# EAGLE design SparkFun_MicroMod_ESP32 (EAGLE 9.5.2)
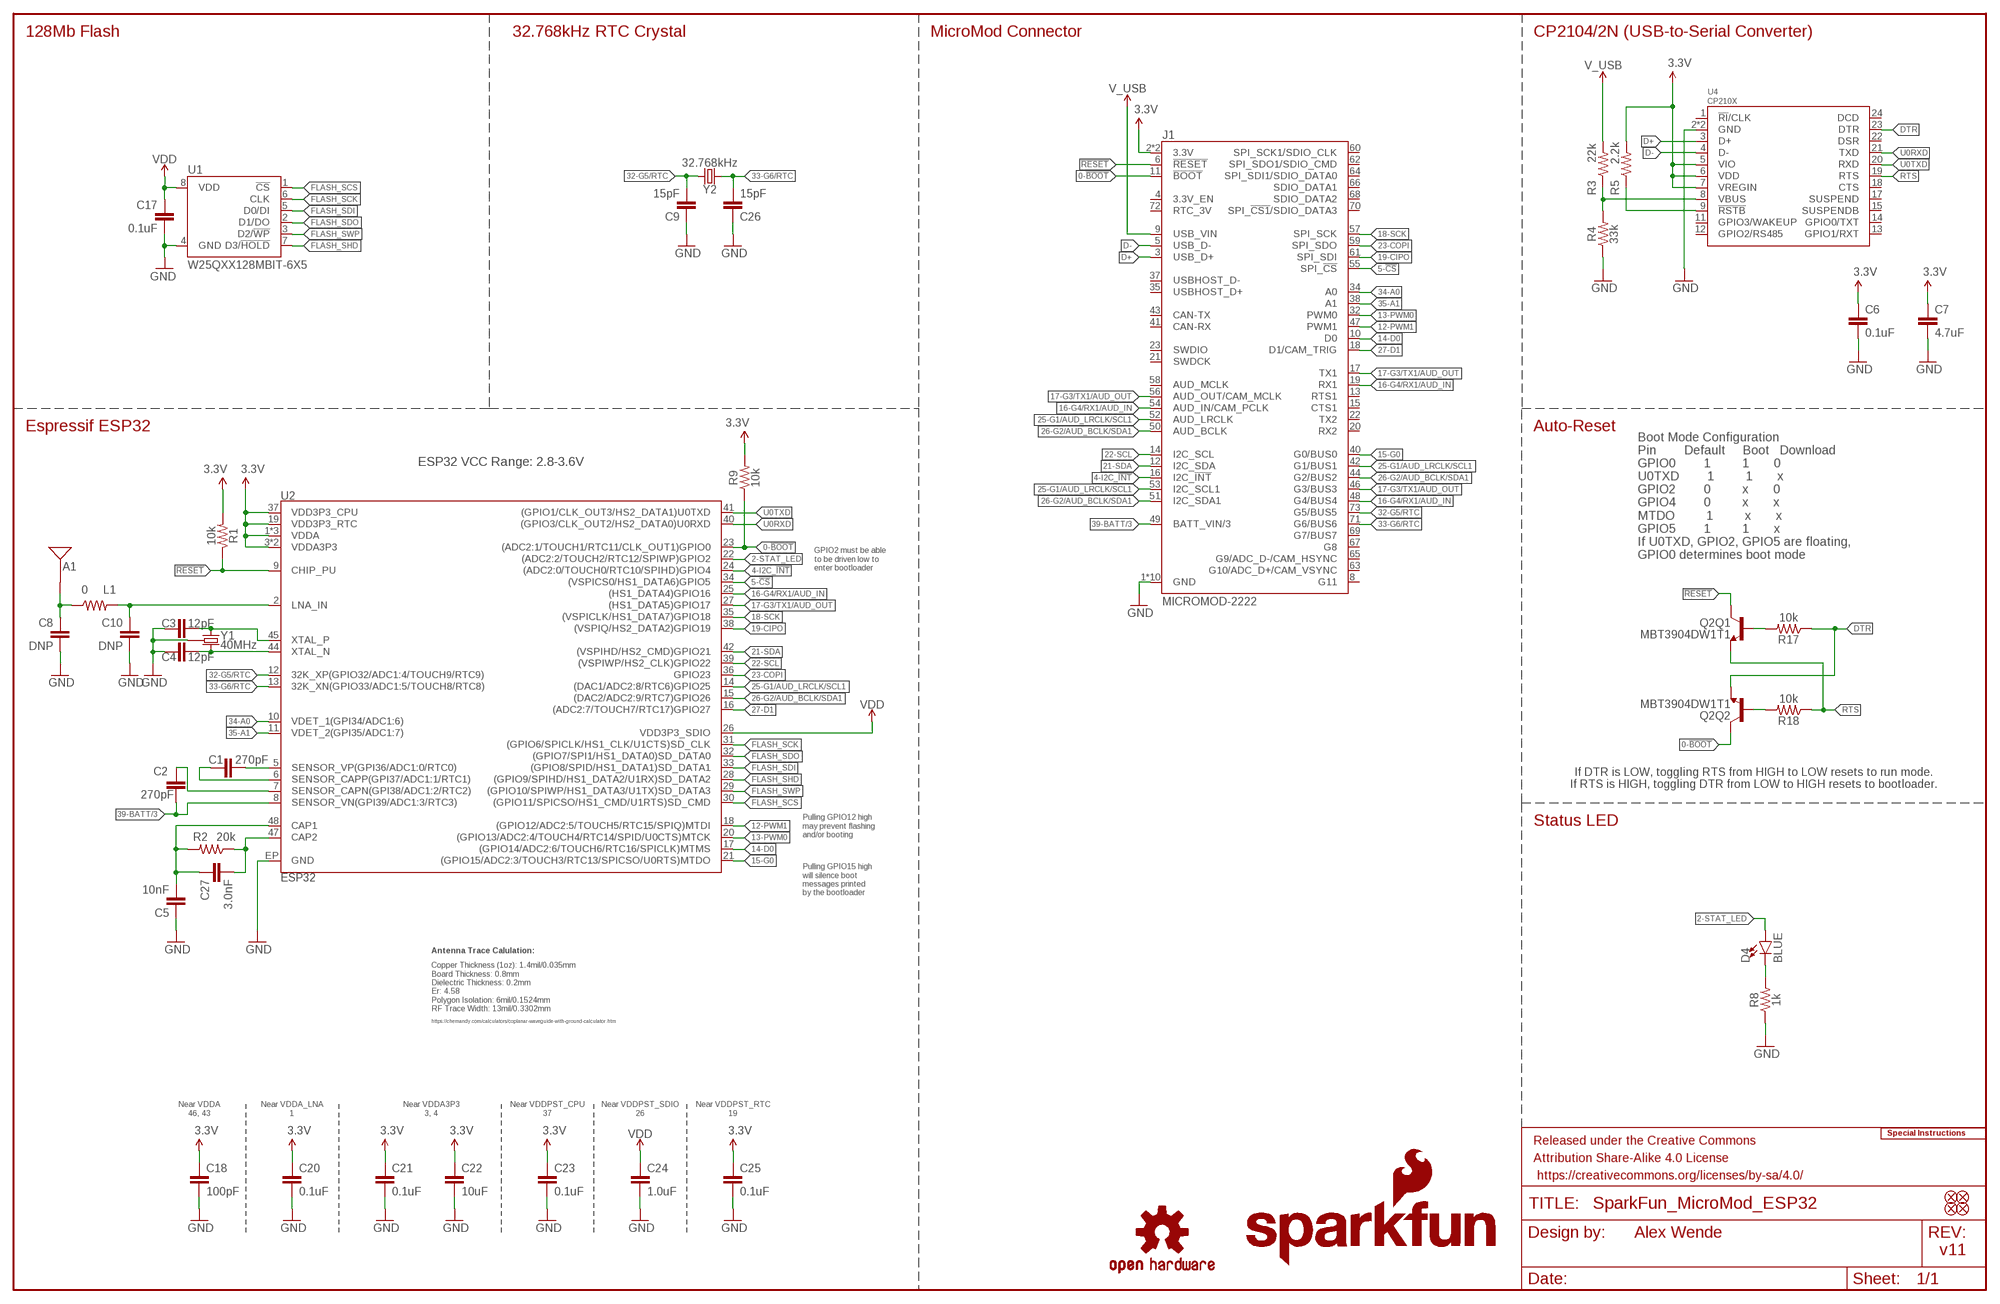
[diagram p0: schematic, sheet 1]

## Parts
A1  ANTENNA2.4GHZ-8.0X1.0MM  [ANT-2.4GHZ-8.0X1.0MM]
C1  270pF  270PF-0402T-50V-5%  [0402-TIGHT]
C2  270pF  270PF-0402T-50V-5%  [0402-TIGHT]
C3  12pF  12PF-0402T-50V-5%  [0402-TIGHT]
C4  12pF  12PF-0402T-50V-5%  [0402-TIGHT]
C5  10nF  10NF-0402T-25V-10%  [0402-TIGHT]
C6  0.1uF  0.1UF-0402T-16V-10%  [0402-TIGHT]
C7  4.7uF  4.7UF-0402_TIGHT-6.3V-20%-X5R  [0402-TIGHT]
C8  DNP  CAP-0402-TIGHT  [0402-TIGHT]
C9  15pF  15PF-0402T-50V-5%  [0402-TIGHT]
C10  DNP  CAP-0402-TIGHT  [0402-TIGHT]
C17  0.1uF  0.1UF-0402T-16V-10%  [0402-TIGHT]
C18  100pF  100PF-0402T-50V-5%  [0402-TIGHT]
C20  0.1uF  0.1UF-0402T-16V-10%  [0402-TIGHT]
C21  0.1uF  0.1UF-0402T-16V-10%  [0402-TIGHT]
C22  10uF  10UF-0402T-6.3V-20%  [0402-TIGHT]
C23  0.1uF  0.1UF-0402T-16V-10%  [0402-TIGHT]
C24  1.0uF  1.0UF-0402T-16V-10%  [0402-TIGHT]
C25  0.1uF  0.1UF-0402T-16V-10%  [0402-TIGHT]
C26  15pF  15PF-0402T-50V-5%  [0402-TIGHT]
C27  3.0nF  3.0NF-0402T-50V-5%  [0402-TIGHT]
D4  BLUE  LED-BLUE0603  [LED-0603]
FD1  FIDUCIALUFIDUCIAL  [FIDUCIAL-MICRO]
FD2  FIDUCIALUFIDUCIAL  [FIDUCIAL-MICRO]
FD3  FIDUCIALUFIDUCIAL  [FIDUCIAL-MICRO]
FD4  FIDUCIALUFIDUCIAL  [FIDUCIAL-MICRO]
FRAME1  FRAME-LEDGER  [CREATIVE_COMMONS]
J1  MICROMOD-2222  [M.2-CARD-E-22]
L1  0  0OHM-0402T-1/10W  [0402-TIGHT]
LOGO1  SPECIAL_INSTRUCTIONS-ORDERING  [ORDERING_INSTRUCTIONS]
LOGO2  SFE_LOGO_NAME_FLAME.1_INCH  [SFE_LOGO_NAME_FLAME_.1]
LOGO3  OSHW-LOGOS  [OSHW-LOGO-S]
Q2  MBT3904DW1T1  TRANS_NPN_DUAL-MBT3904DW1T1  [SC70-6]
R1  10k  10KOHM-0402T-1/16W-1%  [0402-TIGHT]
R2  20k  20KOHM-0402T-1/16W-1%  [0402-TIGHT]
R3  22k  22KOHM-0402_TIGHT-1/10W-1%  [0402-TIGHT]
R4  33k  33KOHM-0402T-1/16W-1%  [0402-TIGHT]
R5  2.2k  2.2KOHM-0402T-1/16W-1%  [0402-TIGHT]
R8  1k  1KOHM-0402T-1/16W-1%  [0402-TIGHT]
R9  10k  10KOHM-0402T-1/16W-1%  [0402-TIGHT]
R17  10k  10KOHM-0402T-1/16W-1%  [0402-TIGHT]
R18  10k  10KOHM-0402T-1/16W-1%  [0402-TIGHT]
U1  W25QXX128MBIT-6X5  [WSON-8-6X5]
U2  ESP32  [QFN48-0.4MM]
U4  CP210X  CP2102N  [QFN24]
Y1  40MHz  CRYSTAL-40MHZ-SMD-2X2.5MM  [CRYSTAL-SMD-2X2.5MM]
Y2  32.768kHz  CRYSTAL-32.768KHZSMD-3.2X1.5  [CRYSTAL-SMD-3.2X1.5MM]

## Nets
0-!BOOT!: J1.11(!BOOT!) Q2.6(Q2:C) R9.1 U2.23((ADC2:1/TOUCH1/RTC11/CLK_OUT1)GPIO0)
2-STAT_LED: D4.A U2.22((ADC2:2/TOUCH2/RTC12/SPIWP)GPIO2)
3.3V: C6.1 C7.1 C18.1 C20.1 C21.1 C22.1 C23.1 C25.1 J1.2(3.3V) J1.74(3.3V) R1.2 R5.2 R9.2 U2.1(VDDA) U2.3(VDDA3P3) U2.4(VDDA3P3) U2.19(VDD3P3_RTC) U2.37(VDD3P3_CPU) U2.43(VDDA) U2.46(VDDA) U4.5(VIO) U4.6(VDD) U4.7(VREGIN)
4-I2C_!INT: J1.16(I2C_!INT!) U2.24((ADC2:0/TOUCH0/RTC10/SPIHD)GPIO4)
5-!CS: J1.55(SPI_!CS!) U2.34((VSPICS0/HS1_DATA6)GPIO5)
12-PWM1: J1.47(PWM1) U2.18((GPIO12/ADC2:5/TOUCH5/RTC15/SPIQ)MTDI)
13-PWM0: J1.32(PWM0) U2.20((GPIO13/ADC2:4/TOUCH4/RTC14/SPID/U0CTS)MTCK)
14-D0: J1.10(D0) U2.17((GPIO14/ADC2:6/TOUCH6/RTC16/SPICLK)MTMS)
15-G0: J1.40(G0/BUS0) U2.21((GPIO15/ADC2:3/TOUCH3/RTC13/SPICSO/U0RTS)MTDO)
16-G4/RX1/AUD_IN: J1.19(RX1) J1.48(G4/BUS4) J1.54(AUD_IN/CAM_PCLK) U2.25((HS1_DATA4)GPIO16)
17-G3/TX1/AUD_OUT: J1.17(TX1) J1.46(G3/BUS3) J1.56(AUD_OUT/CAM_MCLK) U2.27((HS1_DATA5)GPIO17)
18-SCK: J1.57(SPI_SCK) U2.35((VSPICLK/HS1_DATA7)GPIO18)
19-CIPO: J1.61(SPI_SDI) U2.38((VSPIQ/HS2_DATA2)GPIO19)
21-SDA: J1.12(I2C_SDA) U2.42((VSPIHD/HS2_CMD)GPIO21)
22-SCL: J1.14(I2C_SCL) U2.39((VSPIWP/HS2_CLK)GPIO22)
23-COPI: J1.59(SPI_SDO) U2.36(GPIO23)
25-G1/AUD_LRCLK/SCL1: J1.42(G1/BUS1) J1.52(AUD_LRCLK) J1.53(I2C_SCL1) U2.14((DAC1/ADC2:8/RTC6)GPIO25)
26-G2/AUD_BCLK/SDA1: J1.44(G2/BUS2) J1.50(AUD_BCLK) J1.51(I2C_SDA1) U2.15((DAC2/ADC2:9/RTC7)GPIO26)
27-D1: J1.18(D1/CAM_TRIG) U2.16((ADC2:7/TOUCH7/RTC17)GPIO27)
32-G5/RTC: C9.2 J1.73(G5/BUS5) U2.12(32K_XP(GPIO32/ADC1:4/TOUCH9/RTC9)) Y2.P$1
33-G6/RTC: C26.2 J1.71(G6/BUS6) U2.13(32K_XN(GPIO33/ADC1:5/TOUCH8/RTC8)) Y2.P$2
34-A0: J1.34(A0) U2.10(VDET_1(GPI34/ADC1:6))
35-A1: J1.38(A1) U2.11(VDET_2(GPI35/ADC1:7))
36: C1.2 U2.5(SENSOR_VP(GPI36/ADC1:0/RTC0))
37: C1.1 U2.6(SENSOR_CAPP(GPI37/ADC1:1/RTC1))
38: C2.1 U2.7(SENSOR_CAPN(GPI38/ADC1:2/RTC2))
39-BATT/3: C2.2 J1.49(BATT_VIN/3) U2.8(SENSOR_VN(GPI39/ADC1:3/RTC3))
!RESET: J1.6(!RESET!) Q2.3(Q1:C) R1.1 U2.9(CHIP_PU)
CAP_10N: C5.2 C27.1 R2.2 U2.48(CAP1)
D+: J1.3(USB_D+) U4.3(D+)
D-: J1.5(USB_D-) U4.4(D-)
DTR: Q2.1(Q2:E) R17.1 U4.23(DTR)
FLASH_SCK: U1.6(CLK) U2.31((GPIO6/SPICLK/HS1_CLK/U1CTS)SD_CLK)
FLASH_SCS: U1.1(!CS!) U2.30((GPIO11/SPICSO/HS1_CMD/U1RTS)SD_CMD)
FLASH_SDI: U1.5(D0/DI) U2.33((GPIO8/SPID/HS1_DATA1)SD_DATA1)
FLASH_SDO: U1.2(D1/DO) U2.32((GPIO7/SPI1/HS1_DATA0)SD_DATA0)
FLASH_SHD: U1.7(D3/!HOLD!) U2.28((GPIO9/SPIHD/HS1_DATA2/U1RX)SD_DATA2)
FLASH_SWP: U1.3(D2/!WP!) U2.29((GPIO10/SPIWP/HS1_DATA3/U1TX)SD_DATA3)
GND: C3.1 C4.1 C5.1 C6.2 C7.2 C8.2 C9.1 C10.2 C17.2 C18.2 C20.2 C21.2 C22.2 C23.2 C24.2 C25.2 C26.1 J1.1(GND) J1.7(GND) J1.33(GND) J1.36(GND) J1.39(GND) J1.45(GND) J1.75(GND) J1.GND1(GND) J1.GND2(GND) J1.GND3(GND) R4.1 R8.1 U1.4(GND) U2.EP(GND) U4.2(GND) U4.PAD(GND) Y1.P2(GND) Y1.P4(GND)
N$1: D4.C R8.2
N$2: R3.1 R4.2 U4.8(VBUS)
N$3: R5.1 U4.9(!RSTB)
N$4: C27.2 R2.1 U2.47(CAP2)
N$5: A1.FEED(SIGNAL) C8.1 L1.1
N$8: C10.1 L1.2 U2.2(LNA_IN)
N$10: Q2.5(Q1:B) R17.2
N$12: Q2.2(Q2:B) R18.2
N$13: C3.2 U2.45(XTAL_P) Y1.P1
N$15: C4.2 U2.44(XTAL_N) Y1.P3
RTS: Q2.4(Q1:E) R18.1 U4.19(RTS)
U0RXD: U2.40((GPIO3/CLK_OUT2/HS2_DATA0)U0RXD) U4.21(TXD)
U0TXD: U2.41((GPIO1/CLK_OUT3/HS2_DATA1)U0TXD) U4.20(RXD)
V_USB: J1.9(USB_VIN) R3.2
VDD: C17.1 C24.1 U1.8(VDD) U2.26(VDD3P3_SDIO)
Unconnected: J1.4(3.3V_EN) J1.8(G11) J1.13(RTS1) J1.15(CTS1) J1.20(RX2) J1.21(SWDCK) J1.22(TX2) J1.23(SWDIO) J1.35(USBHOST_D+) J1.37(USBHOST_D-) J1.41(CAN-RX) J1.43(CAN-TX) J1.58(AUD_MCLK) J1.60(SPI_SCK1/SDIO_CLK) J1.62(SPI_SDO1/SDIO_CMD) J1.63(G10/ADC_D+/CAM_VSYNC) J1.64(SPI_SDI1/SDIO_DATA0) J1.65(G9/ADC_D-/CAM_HSYNC) J1.66(SDIO_DATA1) J1.67(G8) J1.68(SDIO_DATA2) J1.69(G7/BUS7) J1.70(SPI_!CS1!/SDIO_DATA3) J1.72(RTC_3V) U4.1(!RI!/CLK) U4.11(GPIO3/WAKEUP) U4.12(GPIO2/RS485) U4.13(GPIO1/RXT) U4.14(GPIO0/TXT) U4.15(SUSPENDB) U4.17(SUSPEND) U4.18(CTS) U4.22(DSR) U4.24(DCD)

## Notes on the sheet
- 128Mb Flash | 32.768kHz RTC Crystal | MicroMod Connector | CP2104/2N (USB-to-Serial Converter)
- Espressif ESP32 | Auto-Reset
- ESP32 VCC Range: 2.8-3.6V
- Boot Mode Configuration
  Pin        Default     Boot   Download
  GPIO0        1         1       0
  U0TXD        1         1       x
  GPIO2        0         x       0
  GPIO4        0         x       x
  MTDO         1         x       x
  GPIO5        1         1       x
  If U0TXD, GPIO2, GPIO5 are floating, 
  GPIO0 determines boot mode
- GPIO2 must be able
  to be driven low to 
  enter bootloader
- If DTR is LOW, toggling RTS from HIGH to LOW resets to run mode.
  If RTS is HIGH, toggling DTR from LOW to HIGH resets to bootloader.
- Status LED
- Pulling GPIO12 high
  may prevent flashing
  and/or booting
- Pulling GPIO15 high
  will silence boot
  messages printed
  by the bootloader
- Antenna Trace Calulation:
- Copper Thickness (1oz): 1.4mil/0.035mm
  Board Thickness: 0.8mm
  Dielectric Thickness: 0.2mm
  Er: 4.58
  Polygon Isolation: 6mil/0.1524mm
  RF Trace Width: 13mil/0.3302mm
- https://chemandy.com/calculators/coplanar-waveguide-with-ground-calculator.htm
- Near VDDA
  46, 43
- Near VDDA_LNA
  1
- Near VDDA3P3
  3, 4
- Near VDDPST_CPU
  37
- Near VDDPST_SDIO
  26
- Near VDDPST_RTC
  19
- Alex Wende
- v11

## Library data of the parts
A1 = SparkFun-RF:ANTENNA: Single-ended Antennae 2.4GHz and antennae with just one terminal. These are all chip antennae. 2.4GHz (WiFi/BT/ZigBee) Antennae ANT-2.4GHZ-6.5X2.2MM - 6.5 x 2.2 mm chip antenna. (SparkFun Product <https://www.sparkfun.com/products/144>) ANT-2.4GHZ8.0X1.0MM - 8.0 x 1.0 mm chip antenna. (Datasheet <http://www.mouser.com/ds/2/611/antenna_2500at44m0400-242425.pdf>) ANT-2.4GHZ9.5X2.0MM - 9.5 x 2.0 mm chip antenna. (SparkFun Product <https://www.sparkfun.com/products/9025>); PROD_ID: ANT-14377
C1 C2 = SparkFun-Capacitors:270PF: 270pF/0.27nF ceramic capacitors A capacitor is a passive two-terminal electrical component used to store electrical energy temporarily in an electric field.; PROD_ID: CAP-15129
C3 C4 = SparkFun-Capacitors:12PF: 12pF ceramic capacitors A capacitor is a passive two-terminal electrical component used to store electrical energy temporarily in an electric field.; PROD_ID: CAP-14665
C5 = SparkFun-Capacitors:10NF: 0.01uF/10nF/10,000pF ceramic capacitors A capacitor is a passive two-terminal electrical component used to store electrical energy temporarily in an electric field. CAP-09321; PROD_ID: CAP-14847
C6 C17 C20 C21 C23 C25 = SparkFun-Capacitors:0.1UF: 0.1µF ceramic capacitors A capacitor is a passive two-terminal electrical component used to store electrical energy temporarily in an electric field.; PROD_ID: CAP-12416
C7 = SparkFun-Capacitors:4.7UF: 4.7µF ceramic capacitors A capacitor is a passive two-terminal electrical component used to store electrical energy temporarily in an electric field.; PROD_ID: CAP-14240
C8 C10 = SparkFun-Capacitors:CAP
C9 C26 = SparkFun-Capacitors:15PF: 15pF ceramic capacitors A capacitor is a passive two-terminal electrical component used to store electrical energy temporarily in an electric field.; PROD_ID: CAP-13063
C18 = SparkFun-Capacitors:100PF: 100pF/0.1nF ceramic capacitors A capacitor is a passive two-terminal electrical component used to store electrical energy temporarily in an electric field.; PROD_ID: CAP-13458
C22 = SparkFun-Capacitors:10UF: 10.0µF ceramic capacitors A capacitor is a passive two-terminal electrical component used to store electrical energy temporarily in an electric field.; PROD_ID: CAP-14848
C24 = SparkFun-Capacitors:1.0UF: 1µF ceramic capacitors A capacitor is a passive two-terminal electrical component used to store electrical energy temporarily in an electric field.; PROD_ID: CAP-12417
C27 = SparkFun-Capacitors:3.0NF: 3.0nF (3nF, 3000pF) ceramic capacitors A capacitor is a passive two-terminal electrical component used to store electrical energy temporarily in an electric field.; PROD_ID: CAP-15130
D4 = SparkFun-LED:LED-BLUE: Blue SMD LED Used in manufacturing of various products at SparkFun Packages: 0603 - SMD 0603 package [Product Link] <http://www.digikey.com/product-detail/en/SMLE12BC7TT86/511-1589-2-ND/1641808> 1206 - SMD1206 package [Product Link] <http://www.digikey.com/product-detail/en/lite-on-inc/LTST-C150TBKT/160-1643-1-ND/573584> SparkFun Products: ESP8266 Thing-Dev Board <https://www.sparkfun.com/products/13711> RedBoard <https://www.sparkfun.com/products/12757>; PROD_ID: DIO-08575
FD1-FD4 = SparkFun-Aesthetics:FIDUCIAL: Fiducial Alignment Points Point-of-reference for pick-and-place machines and other optical instruments.
FRAME1 = SparkFun-Aesthetics:FRAME-LEDGER: Schematic Frame - Ledger Standard 11x14 US Ledger frame
J1 = SparkFun-MicroMod:MICROMOD: MicroMod Connector Description: A card edge connector and mating PCB connector to allow various MicroMod Processor Boards to be coupled with various carrier boards of different capabilities. Based on the M.2 standard.
L1 = SparkFun-Resistors:0OHM: 0Ω resistor A resistor is a passive two-terminal electrical component that implements electrical resistance as a circuit element. Resistors act to reduce current flow, and, at the same time, act to lower voltage levels within circuits. - Wikipedia; PROD_ID: RES-14244
LOGO1 = SparkFun-Aesthetics:SPECIAL_INSTRUCTIONS: Special Ordering/Production Instructions Alert Symbol for special PCB ordering instructions or unique production process warnings. Ordering Instructions Production Instructions Types of information that should be added to box: Copper weight Soldermask color Silk color PCB thickness Number of layers PCB Standard: 1.6mm FR4 1 oz copper immersion silver plating red soldermask white silkscreen Types of information that should be added to box: Special wash requirements Depaneling instructions Humidification Glue curing Default text settings: 0.07 inch 9% ratio 50% line distance
LOGO2 = SparkFun-Aesthetics:SFE_LOGO_NAME_FLAME: SparkFun Font Logo w/ Flame This is the SparkFun full logo. The logo on the schematic will always be the same size; the package variant is the height of the flame part of the logo. Default layer for the logo on the board is tSilk.
LOGO3 = SparkFun-Aesthetics:OSHW-LOGO: Open-Source Hardware (OSHW) Logo This logo indicates the piece of hardware it is found on incorporates a OSHW license and/or adheres to the definition of open source hardware found here: http://freedomdefined.org/OSHW
Q2 = SparkFun-DiscreteSemi:TRANS_NPN_DUAL: Dual NPN Transistors in Single Package The MBT3904W1 puts two general purpose 3904 NPN transistors in a single package. Datasheet <http://www.onsemi.com/pub_link/Collateral/MBT3904DW1T1-D.PDF> SparkFun Products: SparkFun ESP32 Thing <https://www.sparkfun.com/products/13907>; PROD_ID: TRANS-13337
R1 R9 R17 R18 = SparkFun-Resistors:10KOHM: 10kΩ resistor A resistor is a passive two-terminal electrical component that implements electrical resistance as a circuit element. Resistors act to reduce current flow, and, at the same time, act to lower voltage levels within circuits. - Wikipedia; PROD_ID: RES-14241
R2 = SparkFun-Resistors:20KOHM: 20kΩ resistor A resistor is a passive two-terminal electrical component that implements electrical resistance as a circuit element. Resistors act to reduce current flow, and, at the same time, act to lower voltage levels within circuits. - Wikipedia; PROD_ID: RES-15131
R3 = SparkFun-Resistors:22KOHM: 22kΩ resistor A resistor is a passive two-terminal electrical component that implements electrical resistance as a circuit element. Resistors act to reduce current flow, and, at the same time, act to lower voltage levels within circuits. - Wikipedia; PROD_ID: RES-14281
R4 = SparkFun-Resistors:33KOHM: 33kΩ resistor A resistor is a passive two-terminal electrical component that implements electrical resistance as a circuit element. Resistors act to reduce current flow, and, at the same time, act to lower voltage levels within circuits. - Wikipedia; PROD_ID: RES-15128
R5 = SparkFun-Resistors:2.2KOHM: 2.2kΩ resistor A resistor is a passive two-terminal electrical component that implements electrical resistance as a circuit element. Resistors act to reduce current flow, and, at the same time, act to lower voltage levels within circuits. - Wikipedia; PROD_ID: RES-14341
R8 = SparkFun-Resistors:1KOHM: 1kΩ resistor A resistor is a passive two-terminal electrical component that implements electrical resistance as a circuit element. Resistors act to reduce current flow, and, at the same time, act to lower voltage levels within circuits. - Wikipedia; PROD_ID: RES-14342
U1 = SparkFun-MicroMod:W25QXX; PROD_ID: IC-15107
U2 = SparkFun-RF:ESP32: Espressif ESP32 WiFi-compatible SoC microcontroller. Bluetooth Low energy support (BLE, BT4.0, Bluetooth Smart) 28 GPIO pins Dual-core Tensilica LX6 microprocessor Hardware accelerated encryption (AES, SHA2, ECC, RSA-4096) 4MB Flash memory 520kB internal SRAM Datasheet <https://cdn.sparkfun.com/datasheets/IoT/esp32_datasheet_en.pdf> SparkFun Products: SparkFun ESP32 Thing <https://www.sparkfun.com/products/13907>; PROD_ID: IC-13338
U4 = SparkFun-IC-Comms:CP2102N; PROD_ID: IC-14020
Y1 = SparkFun-Clocks:CRYSTAL-40MHZ: 40MHz Crystal w/ Ground Pin Digikey Example <https://www.digikey.com/product-detail/en/epson/FA-20H-40-0000MF10Z-K3/SER4045CT-ND/5175137> Frequency: 40MHz Frequency Stability: ±10ppm Frequency Tolerance: ±10ppm Load Capacitance: 10pF; PROD_ID: XTAL-15127; VALUE: 40MHZ
Y2 = SparkFun-Clocks:CRYSTAL-32.768KHZ: 32.768kHz Crystal Frequency: 32.768kHz Frequency Stability: ±20ppm Load Capacitance: 12.5pF (PTH-2X6 & SMD-3.2X1.5), 6pF (SMD-2X6) SparkFun Products: SparkFun BigTime Watch Kit <https://www.sparkfun.com/products/11734> SparkFun nRF52832 Breakout <https://www.sparkfun.com/products/13990> SparkFun Real Time Clock Module <https://www.sparkfun.com/products/12708>; PROD_ID: XTAL-13062

## Board
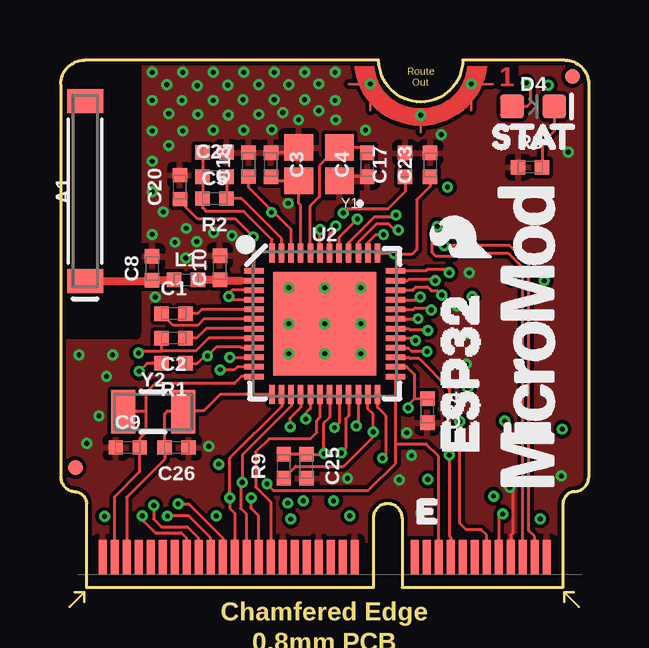
[diagram p1: board, top side]
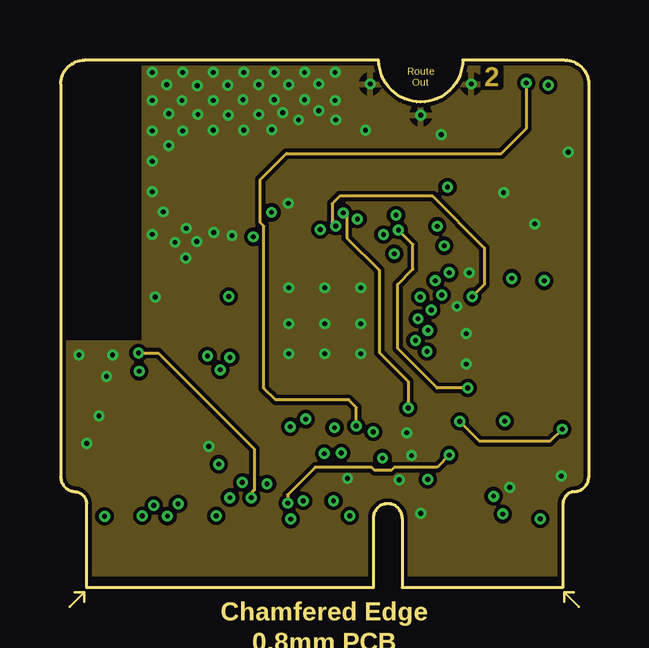
[diagram p2: board, inner layer GND]
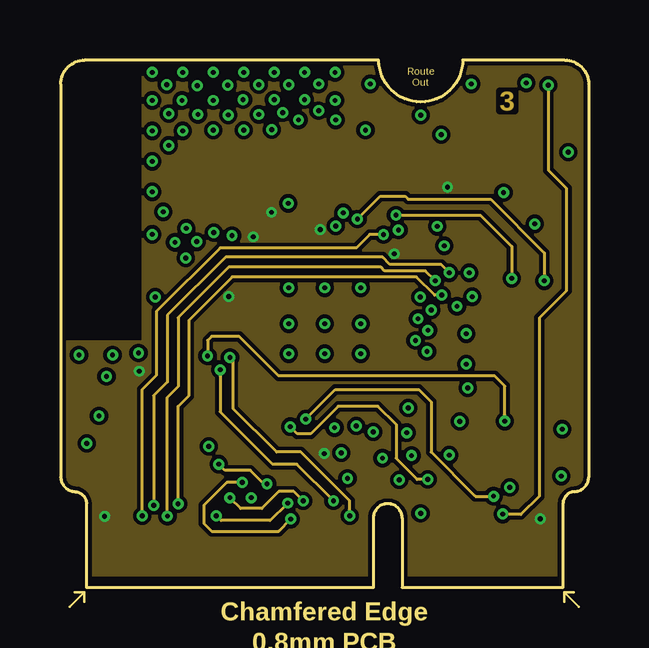
[diagram p3: board, inner layer PWR]
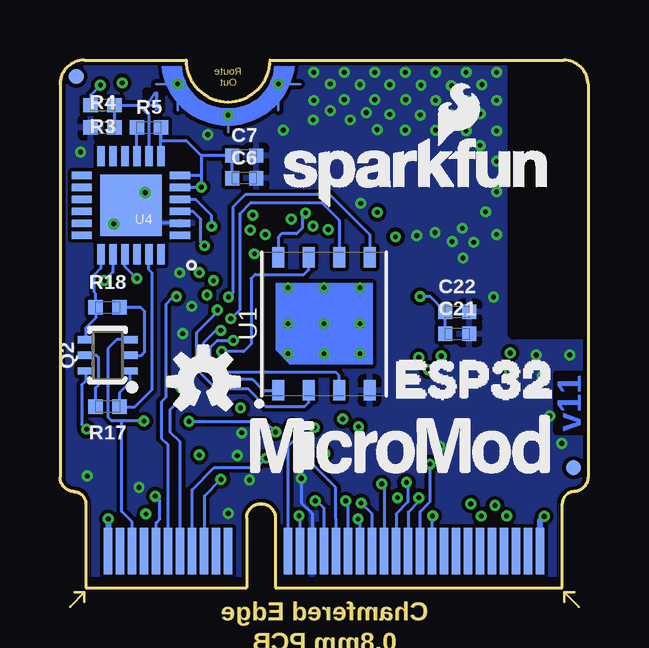
[diagram p4: board, bottom side, seen from below]

Size 22 x 22 mm. Coordinates in mm from the lower left corner, seen from the top.
Outline: 16.75,22 21,22 arc-87 22,21 22,4.6 arc-87 21.4,4 arc85 20.93,3.5 20.93,0 14.22,0 14.22,2.9 arc180 13.03,2.9 13.03,0 1.07,0 1.07,3.5 arc84 0.6,4 arc-87 0,4.6 0,21 arc-87 1,22 13.25,22
Outline: 16.75,22 arc-180 13.25,22
Outline: 16.75,22 arc-180 13.25,22
Copper layers (1*2*15*16): Top 0.035559375mm / dielectric 0.47751875mm / GND 0.035559375mm / dielectric 0.47751875mm / PWR 0.035559375mm / dielectric 0.47751875mm / Bottom 0.035559375mm
Design rules "SparkFun-4-layer-FAB-LIMIT": minimum track width 4mil, minimum drill 6mil, track to track 5mil, track to pad 5mil, pad to pad 5mil, via to via 5mil, smd to smd 5mil, copper to edge 4mil, drill to drill 4mil, minimum pad ring 5mil, minimum via ring 5mil, stop-mask expansion 4mil, vias tented up to drill 25mil, thermal gap 10mil
tRestrict: area 0,10.6 to 3.1,22
bRestrict: area 0,10.6 to 3.1,22; 4 lines

### Footprints (pad centres in the part's own frame; a part is rotated, then mirrored left to right if it is on the bottom)
ANT-2.4GHZ-8.0X1.0MM = smd 1 x 1.5: FEED -3.75,0; NC 3.75,0
0402-TIGHT = smd 0.6 x 0.6: 1 -0.5,0; 2 0.5,0
LED-0603 = smd 1 x 1: A -0.877,0; C 0.877,0
FIDUCIAL-MICRO = smd 0.635 x 0.635: 1 0,0
M.2-CARD-E-22 = smd 0.35 x 1.45: 1 9.25,1.275; 3 8.75,1.275; 5 8.25,1.275; 7 7.75,1.275; 9 7.25,1.275; 11 6.75,1.275; 13 6.25,1.275; 15 5.75,1.275; 17 5.25,1.275; 19 4.75,1.275; 21 4.25,1.275; 23 3.75,1.275; 33 1.25,1.275; 35 0.75,1.275; 37 0.25,1.275; 39 -0.25,1.275; 41 -0.75,1.275; 43 -1.25,1.275; 45 -1.75,1.275; 47 -2.25,1.275; 49 -2.75,1.275; 51 -3.25,1.275; 53 -3.75,1.275; 55 -4.25,1.275; 57 -4.75,1.275; 59 -5.25,1.275; 61 -5.75,1.275; 63 -6.25,1.275; 65 -6.75,1.275; 67 -7.25,1.275; 69 -7.75,1.275; 71 -8.25,1.275; 73 -8.75,1.275; 75 -9.25,1.275 | smd 0.35 x 1.95 bottom: 2 9,1.525; 4 8.5,1.525; 6 8,1.525; 8 7.5,1.525; 10 7,1.525; 12 6.5,1.525; 14 6,1.525; 16 5.5,1.525; 18 5,1.525; 20 4.5,1.525; 22 4,1.525; 32 1.5,1.525; 34 1,1.525; 36 0.5,1.525; 38 0,1.525; 40 -0.5,1.525; 42 -1,1.525; 44 -1.5,1.525; 46 -2,1.525; 48 -2.5,1.525; 50 -3,1.525; 52 -3.5,1.525; 54 -4,1.525; 56 -4.5,1.525; 58 -5,1.525; 60 -5.5,1.525; 62 -6,1.525; 64 -6.5,1.525; 66 -7,1.525; 68 -7.5,1.525; 70 -8,1.525; 72 -8.5,1.525; 74 -9,1.525 | drill 0.2: GND1 1.9,21; GND2 4,19.7; GND3 6.1,21
SC70-6 = smd 0.3 x 0.66: 1 -0.65,-0.92; 2 0,-0.92; 3 0.65,-0.92; 4 0.65,0.92; 5 0,0.92; 6 -0.65,0.92
WSON-8-6X5 = smd 0.85 x 0.5: 1 -2.775,1.905; 2 -2.775,0.635; 3 -2.775,-0.635; 4 -2.775,-1.905; 5 2.775,-1.905; 6 2.775,-0.635; 7 2.775,0.635; 8 2.775,1.905
QFN48-0.4MM = smd 0.8 x 0.23: 1 -2.95,2.2; 2 -2.95,1.8; 3 -2.95,1.4; 4 -2.95,1; 5 -2.95,0.6; 6 -2.95,0.2; 7 -2.95,-0.2; 8 -2.95,-0.6; 9 -2.95,-1; 10 -2.95,-1.4; 11 -2.95,-1.8; 12 -2.95,-2.2; 25 2.95,-2.2; 26 2.95,-1.8; 27 2.95,-1.4; 28 2.95,-1; 29 2.95,-0.6; 30 2.95,-0.2; 31 2.95,0.2; 32 2.95,0.6; 33 2.95,1; 34 2.95,1.4; 35 2.95,1.8; 36 2.95,2.2 | smd 0.23 x 0.8: 13 -2.2,-2.95; 14 -1.8,-2.95; 15 -1.4,-2.95; 16 -1,-2.95; 17 -0.6,-2.95; 18 -0.2,-2.95; 19 0.2,-2.95; 20 0.6,-2.95; 21 1,-2.95; 22 1.4,-2.95; 23 1.8,-2.95; 24 2.2,-2.95; 37 2.2,2.95; 38 1.8,2.95; 39 1.4,2.95; 40 1,2.95; 41 0.6,2.95; 42 0.2,2.95; 43 -0.2,2.95; 44 -0.6,2.95; 45 -1,2.95; 46 -1.4,2.95; 47 -1.8,2.95; 48 -2.2,2.95 | smd 4.3 x 4.3: EP 0,0
QFN24 = smd 0.85 x 0.3: 1 -2.05,1.25; 2 -2.05,0.75; 3 -2.05,0.25; 4 -2.05,-0.25; 5 -2.05,-0.75; 6 -2.05,-1.25; 13 2.05,-1.25; 14 2.05,-0.75; 15 2.05,-0.25; 16 2.05,0.25; 17 2.05,0.75; 18 2.05,1.25 | smd 0.3 x 0.85: 7 -1.25,-2.05; 8 -0.75,-2.05; 9 -0.25,-2.05; 10 0.25,-2.05; 11 0.75,-2.05; 12 1.25,-2.05; 19 1.25,2.05; 20 0.75,2.05; 21 0.25,2.05; 22 -0.25,2.05; 23 -0.75,2.05; 24 -1.25,2.05 | smd 2.55 x 2.55: PAD 0,0
CRYSTAL-SMD-2X2.5MM = smd 1.2 x 1.1: P1 0.846,0.69; P2 -0.854,0.69; P3 -0.854,-0.71; P4 0.846,-0.71
CRYSTAL-SMD-3.2X1.5MM = smd 1 x 1.8: P$1 -1.25,0; P$2 1.25,0

### Placement (x,y rotation side)
A1  1.02,16.54 90 top
C1  4.7,11.42 0 top
C2  4.7,10.4 180 top
C3  8.76,17.63 270 top
C4  12.77,17.63 90 top
C5  6.41,18.14 180 top
C6  14.32,17.06 0 bottom
C7  14.32,18.01 0 bottom
C8  3.81,13.31 90 top
C9  2.79,5.84 0 top
C10  6.63,13.34 90 top
C17  14.35,17.62 90 top
C18  7.83,17.64 90 top
C20  4.97,16.7 90 top
C21  5.45,10.58 0 bottom
C22  5.45,11.5 0 bottom
C23  15.39,17.62 90 top
C24  15.28,7.37 270 top
C25  10.24,5.06 270 top
C26  4.83,5.84 180 top
C27  6.41,17.13 0 top
D4  19.68,20.07 0 top
FD1  0.61,5 0 top
FD2  0.6,5 0 bottom
FD3  21.32,21.3 0 bottom
FD4  21.32,21.3 0 top
FRAME1  -10.01,-23.06 0 top  (outside the outline)
J1  11,0 0 top
L1  5.22,12.83 0 top
LOGO1  30.48,50.8 0 top  (outside the outline)
LOGO2  7.11,17.32 0 bottom
LOGO3  16.03,8.59 0 bottom
Q2  20.02,9.69 90 bottom
R1  4.7,9.35 180 top
R2  6.41,16.22 180 top
R3  20.23,20.11 180 bottom
R4  20.23,19.18 0 bottom
R5  18.29,19.18 0 bottom
R8  19.56,17.53 0 top
R9  9.29,5.06 90 top
R17  20.02,7.54 180 bottom
R18  20.02,11.68 0 bottom
U1  11,11 90 bottom
U2  11,11 0 top
U4  19.04,15.94 180 bottom
U$1  [STAT0]  17.02,18.8 0 top
U$2  [MICROMOD_LOGO_.5]  19.43,10.46 90 top
U$3  [ESP321]  16.64,4.24 90 top
U$4  [SFE_LOGO_FLAME_.1]  16.64,14.61 90 top
U$6  [MICROMOD_LOGO_.5]  7.82,5.94 0 bottom
U$7  [ESP321]  9.42,8.69 0 bottom
Y1  10.76,17.64 180 top
Y2  3.85,7.33 0 top

### Tracks (layer width: path | path; a pad name or v marks a point on that pad's centre or on a via)
0-!BOOT!  (via drill 0.2)
  Top 0.127: U2.23 12.8,7.46 13.02,7.24 v13.02,6.49 13.02,6.29 11.79,5.06 9.79,5.06 R9.1 | J1.11 17.75,2.19 17.53,2.41 16.89,2.41 16.63,2.68 v16.63,6.92
  GND 0.127: v20.89,6.6 20.38,6.1 17.45,6.1 v16.63,6.92
  Bottom 0.127: v16.63,6.92 16.12,6.92 16.1,6.93 13.46,6.93 v13.02,6.49 | v20.89,6.6 21.1,6.81 21.1,8.45 20.93,8.62 Q2.6
2-STAT_LED  (via drill 0.2)
  Top 0.127: U2.22 12.4,6.83 v12.32,6.74 | v19.4,21.04 19.59,20.85 19.59,20.23 19.43,20.07 D4.A
  GND 0.127: v19.4,21.04 19.4,19.14 18.36,18.1 9.4,18.1 8.32,17.02 8.32,15.21 8.47,15.06 8.47,8.31 8.95,7.82 12,7.82 12.32,7.51 v12.32,6.74
3.3V  (via drill 0.2)
  Top 0.127: U2.43 10.8,14.91 v10.82,14.93 | U2.46 9.6,14.93 8.88,15.65 v8.78,15.65 8.78,15.73 7.83,16.68 C18.1 | U2.1 8.05,14.6 v8.02,14.63 7.28,15.37 5.71,15.37 4.97,16.11 C20.1 | U2.4 7.13,12 v7,12.13 7,12.26 7.14,12.4 U2.3 | U2.37 13.87,13.95 v13.9,13.92 14.65,13.92 14.83,14.1 14.83,16.17 15.39,16.73 C23.1 | R1.2 3.6,9.35 v3.27,9.02 | R9.2 C25.1 10.89,5.56 10.92,5.59 v10.98,5.59 10.95,5.62 10.95,6.84 11.2,7.1 U2.19
  Bottom 0.127: U4.5 v16.12,16.69 v16.11,16.7 16.11,17.19 | U4.7 R5.2 17.79,18.64 16.75,18.64 16.11,18.01 | C21.1 C22.1 6.58,12.13 v7,12.13 | U4.6 16.11,17.19 | 16.11,18.01 C7.1 C6.1 | 16.11,18.01 16.11,17.19
  Bottom 0.254: J1.2 20,2.87 v19.98,2.87 | J1.74 2,2.79 v1.83,2.96
  pour PWR (isolate 0.152, rank 2): 0,0.51 0,10.26 3.43,10.26 3.43,22 22,22 22,0.51
4-I2C_!INT  (via drill 0.2)
  Top 0.127: v13.4,5.39 13.53,5.52 13.53,7.17 13.2,7.5 U2.24
  Bottom 0.127: J1.16 16.5,4.07 15.57,5 13.8,5 v13.4,5.39
5-!CS  (via drill 0.2)
  Top 0.127: U2.34 14.67,12.4 14.81,12.54 15.27,12.54 15.43,12.38 15.69,12.38 v15.88,12.19 | v4.89,3.49 5.34,3.49 6.75,2.08 J1.55
  PWR 0.127: v15.88,12.19 15.58,12.19 14.82,12.95 7.14,12.95 5.33,11.15 5.33,8 4.89,7.55 v4.89,3.49
12-PWM1
  Top 0.127: U2.18 10.8,7.11 10.67,6.98 10.67,6.48 10.4,6.21 8.68,6.21 8.12,5.65 8.12,4.2 8.75,3.57 J1.47
13-PWM0  (via drill 0.2)
  Top 0.127: U2.20 11.6,6.86 v11.41,6.67
  Bottom 0.127: v11.41,6.67 11.73,6.67 12.5,5.9 J1.32 | v11.41,6.67
14-D0  (via drill 0.2)
  Top 0.127: U2.17 10.4,7.47 10.21,7.28 v10.21,7.03
  PWR 0.127: v10.21,7.03 11.44,8.26 14.92,8.26 15.43,7.75 15.43,5.65 17.27,3.81 v18.03,3.81
  Bottom 0.127: J1.10 18,2.7 17.84,2.86 17.84,3.62 v18.03,3.81
15-G0  (via drill 0.2)
  Top 0.127: U2.21 12,7.16 11.87,7.03 11.87,5.8 v11.69,5.62
  Bottom 0.127: J1.40 10.5,2.86 10.52,2.88 10.52,4.17 11.69,5.34 v11.69,5.62
16-G4/RX1/AUD_IN  (via drill 0.2)
  Top 0.127: J1.19 15.75,5.46 15.24,5.97 13.95,5.97 | v8.6,4.32 8.87,4.05 12.81,4.05 13.95,5.19 13.95,5.97 | 13.95,5.97 U2.25
  PWR 0.127: v6.59,5.14 6.84,4.89 7.9,4.89 8.47,4.32 v8.6,4.32
  Bottom 0.127: v6.59,5.14 6.59,3.58 7,3.16 J1.54 | v8.6,4.32 8.5,4.22 J1.48
17-G3/TX1/AUD_OUT  (via drill 0.2)
  Top 0.127: U2.27 14.51,9.6 14.56,9.55 14.93,9.55 16.19,8.29 v16.19,5.52 16.19,2.16 16.25,2.1 J1.17
  GND 0.127: v9.45,3.52 9.45,3.87 10.6,5.02 12.95,5.02 13.08,4.89 13.78,4.89 13.91,5.02 14.99,5.02 15.68,5.02 v16.19,5.52
  PWR 0.127: v6.48,2.98 6.67,2.79 8.73,2.79 v9.45,3.52
  Bottom 0.127: J1.56 6.5,2.98 v6.48,2.98 | J1.46 9,3.06 v9.45,3.52
18-SCK  (via drill 0.2)
  Top 0.127: U2.35 14.46,12.8 14.51,12.85 15.55,12.85 v15.6,12.79 | J1.57 6.25,2.07 5.33,2.98 v4.45,2.98
  PWR 0.127: v15.6,12.79 15.19,13.21 13.48,13.21 13.33,13.36 7,13.36 4.89,11.25 4.89,8.38 4.45,7.93 v4.45,2.98
19-CIPO  (via drill 0.2)
  Top 0.127: U2.38 12.8,14.39 13.13,14.72 v13.45,14.72 | J1.61 5.25,2.05 5.02,2.29 3.94,2.29 3.39,2.83 v3.39,2.98
  PWR 0.127: v13.45,14.72 12.88,14.72 12.32,14.16 6.64,14.16 4,11.53 4,8.86 3.39,8.26 v3.39,2.98
21-SDA  (via drill 0.2)
  Top 0.127: v11.46,15.07 11.46,15.01 11.2,14.75 U2.42
  GND 0.127: v17.14,12.13 17.65,12.64 17.65,14.16 15.49,16.32 11.62,16.32 11.3,16 11.3,15.23 v11.46,15.07
  Bottom 0.127: v17.14,12.13 17.27,12.13 17.59,11.81 17.59,7.94 17.78,7.75 17.78,6.22 17.5,5.94 J1.12
22-SCL  (via drill 0.2)
  Top 0.127: U2.39 12.4,14.4 13.15,15.15 13.67,15.15 13.92,14.9 v14.07,14.9
  GND 0.127: v16.96,8.32 15.68,8.32 14.03,9.97 14.03,12.64 14.67,13.27 14.67,14.3 v14.07,14.9
  Bottom 0.127: J1.14 17,6.08 17.4,6.48 17.4,7.43 16.96,7.87 v16.96,8.32
23-COPI  (via drill 0.2)
  Top 0.127: v16.19,13.13 16.07,13.25 15.27,13.25 15.22,13.2 U2.36 | J1.59 5.75,2.06 5.27,2.54 4.19,2.54 3.87,2.86 v3.87,3.43
  PWR 0.127: v16.19,13.13 15.85,13.47 13.72,13.47 13.41,13.78 6.87,13.78 4.45,11.36 4.45,8.57 3.87,8 v3.87,3.43
25-G1/AUD_LRCLK/SCL1  (via drill 0.2)
  Top 0.127: U2.14 9.2,7.55 7.05,5.4 v7.05,3.75 7.05,3.3 7.25,3.1 J1.53
  PWR 0.127: v7.05,3.75 7.49,3.3 8.39,3.3 9.08,4 9.72,4 v10.1,3.62
  Bottom 0.127: v7.05,3.75 7.05,3.59 7.5,3.14 J1.52 | J1.42 10,3.52 v10.1,3.62
26-G2/AUD_BCLK/SDA1  (via drill 0.2)
  Top 0.127: U2.15 9.6,7.57 7.56,5.53 v7.56,4.38 7.5,4.32 7.5,3.29 7.75,3.05 J1.51
  PWR 0.127: v7.56,4.38 6.92,4.38 5.97,3.43 5.97,2.67 6.29,2.35 9.07,2.35 v9.58,2.86
  Bottom 0.127: v7.56,4.38 7.5,4.32 7.5,3.57 8,3.07 J1.50 | J1.44 9.5,2.77 v9.58,2.86
27-D1  (via drill 0.2)
  Top 0.127: U2.16 10,7.51 9.56,7.07 v9.56,6.71
  PWR 0.127: v15.29,4.51 14.85,4.51 13.97,5.39 13.97,6.8 13.22,7.56 11.56,7.56 10.41,6.41 9.86,6.41 v9.56,6.71
  Bottom 0.127: v15.29,4.51 16,3.8 J1.18
32-G5/RTC
  Top 0.127: U2.12 7.53,8.8 7.24,8.51 3.94,8.51 3.55,8.12 3.55,7.37 | 3.55,7.37 3.55,6.48 3.29,6.22 C9.2 3.29,4.83 2.25,3.79 J1.73 | Y2.P$1 2.63,7.37 3.55,7.37
33-G6/RTC
  Top 0.127: 5.07,7.37 4.45,7.37 4.33,7.25 C26.2 4.33,5.34 2.75,3.77 J1.71 | 5.07,7.37 Y2.P$2 | U2.13 6.65,8.05 5.97,7.37 5.07,7.37
34-A0  (via drill 0.2)
  Top 0.127: v7.05,9.6 U2.10
  PWR 0.127: v12.04,2.98 12.04,3.62 10.01,5.65 8.99,5.65 7.18,7.47 7.18,9.47 v7.05,9.6
  Bottom 0.127: J1.34 12,2.94 v12.04,2.98
35-A1  (via drill 0.2)
  Top 0.127: U2.11 7.36,9.2 7.24,9.08 v6.64,9.08
  PWR 0.127: v11.37,3.62 9.84,5.14 8.83,5.14 6.64,7.33 v6.64,9.08
  Bottom 0.127: J1.38 11,3.3 11.32,3.62 v11.37,3.62
36
  Top 0.127: U2.5 5.88,11.6 5.71,11.42 C1.2 | U2.5
37
  Top 0.127: U2.6 5.97,11.2 5.7,10.93 4.69,10.93 C1.1
38
  Top 0.127: U2.7 6.07,10.8 5.67,10.4 C2.1
39-BATT/3  (via drill 0.2)
  Top 0.127: U2.8 6.47,10.4 6.16,10.4 5.63,9.87 4.2,9.87 | 4.2,9.87 C2.2 | v3.24,9.78 3.33,9.87 4.2,9.87 | J1.49 8.25,2.98 7.94,3.3 v7.94,3.75
  GND 0.127: v3.24,9.78 4.06,9.78 8.06,5.78 8.06,4.06 7.94,3.94 v7.94,3.75
!RESET  (via drill 0.2)
  Top 0.127: U2.9 7.54,10 7.52,10.03 6.48,10.03 v6.12,9.66 5.99,9.66 5.68,9.35 R1.1
  PWR 0.127: v18.5,6.94 18.5,8.4 18.08,8.83 9.08,8.83 7.43,10.48 6.29,10.48 6.12,10.31 v6.12,9.66
  Bottom 0.127: Q2.3 19.64,10.34 20.01,9.96 20.01,7.11 19.84,6.94 19.43,6.94 | v18.5,6.94 19.43,6.94 | J1.6 19,2.74 19.43,3.17 19.43,6.94
CAP_10N
  Top 0.127: U2.48 8.8,14.52 7.63,15.68 6.06,15.68 5.91,15.84 R2.2 C27.1 C5.2
D+  (via drill 0.2)
  Top 0.127: J1.3 19.75,2.13 19.51,2.37 19.51,13.46 18.72,14.25 v15.98,14.25
  Bottom 0.127: U4.3 16.46,15.69 16.13,15.36 16.13,14.4 v15.98,14.25
D-  (via drill 0.2)
  Top 0.127: J1.5 19.25,13.35 18.68,13.92 16.5,13.92 16.39,13.81 15.65,13.81 15.49,13.97 15.49,14.87 v15.69,15.06
  Bottom 0.127: v15.69,15.06 15.69,15.52 16.36,16.19 U4.4
DTR
  Bottom 0.127: U4.23 18.29,13.26 18.17,13.13 18.17,8.25 18.88,7.54 19.51,7.54 R17.1 19.52,8.13 19.09,8.55 Q2.1
FLASH_SCK  (via drill 0.2)
  Top 0.127: U2.31 14.85,11.2 14.85,11.21 v14.88,11.21
  Bottom 0.127: v14.88,11.21 14.52,11.57 14.52,15.58 14.05,16.05 11.1,16.05 10.37,15.32 U1.6
FLASH_SCS  (via drill 0.2)
  Top 0.127: U2.30 14.51,10.8 14.56,10.75 15.3,10.75 v15.3,10.73
  Bottom 0.127: v15.3,10.73 15.5,10.73 16.02,10.21 16.02,9.29 15.4,8.67 13.97,8.67 13.52,8.22 U1.1
FLASH_SDI  (via drill 0.2)
  Top 0.127: U2.33 14.86,12 v14.98,12.12
  Bottom 0.127: v14.98,12.12 14.8,12.3 14.8,15.86 14.27,16.38 10.75,16.38 9.1,14.72 U1.5
FLASH_SDO  (via drill 0.2)
  Top 0.127: U2.32 14.71,11.6 14.77,11.66 15.35,11.66 v15.44,11.57
  Bottom 0.127: U1.2 11.63,7.72 11.79,7.56 13.44,7.56 14.16,8.28 15.48,8.28 16.3,9.1 16.3,10.63 15.44,11.49 v15.44,11.57
FLASH_SHD  (via drill 0.2)
  Top 0.127: v15.26,9.84 14.63,9.84 14.47,10 U2.28
  Bottom 0.127: v15.26,9.84 14.35,9.84 14.03,10.16 14.03,12.89 13.87,13.05 11.84,13.05 11.63,13.26 U1.7
FLASH_SWP  (via drill 0.2)
  Top 0.127: v14.78,10.3 14.69,10.4 U2.29
  Bottom 0.127: v14.78,10.3 15.45,10.3 15.74,10.01 15.74,9.44 15.27,8.97 10.5,8.97 10.37,8.84 U1.3
GND  (via drill 0.2)
  Top 0.127: Y1.P4 9.69,18.13 C3.1 | C4.1 11.79,17.13 Y1.P2 | v18.71,4.18 18.84,4.05 18.84,2.26 18.75,2.17 J1.7
  Bottom 0.127: U4.2 18.47,15.19 | 18.47,15.19 19.73,15.19 v19.75,15.16 | U4.PAD 19.04,15.77 18.47,15.19 | v11.95,4.55 11.95,3.53 11.5,3.09 J1.36
  other vias: 20.86,4.65 9.5,12.5 12.5,12.5 11,12.5 9.5,11 11,11 12.5,11 12.5,9.75 11,9.75 9.5,9.75 1.09,6.01 18.45,16.47 3.94,12.11 3.81,14.73 3.81,16.5 3.81,17.77 3.81,19.04 3.81,20.31 3.81,21.48 5.08,21.48 6.35,21.48 7.62,21.48 8.89,21.48 10.16,21.48 11.43,21.48 5.05,20.31 5.08,19.04 4.5,18.43 4.5,19.75 4.42,20.97 5.69,20.92 5.72,19.73 6.35,19.07 7.62,19.07 8.79,19.09 9.91,19.5 11.46,19.5 12.7,19.07 15.85,18.89 6.35,20.31 7.59,20.34 8.89,20.34 10.16,20.34 11.43,20.31 6.99,19.7 8.26,19.73 8.26,20.97 6.96,20.95 9.5,20.97 10.74,21 10.74,19.88 9.25,19.81 4.27,15.67 5.23,14.98 4.76,14.4 5.21,13.74 5.66,14.42 6.38,14.8 7.14,14.68 9.47,16.02 14.42,6.46 6.17,5.88 0.76,9.7 2.16,9.7 1.91,8.81 1.6,7.15 14.99,3.09 14.61,5.5 14.11,4.49 21.15,18.16 17.02,13.13 16.51,11.73 16.89,10.59 16.89,9.32
  pour Top (isolate 0.152, rank 2): 0,1.91 0,22 22,22 22,1.91
  pour Bottom (isolate 0.152, rank 2): 0,0.51 0,22 22,22 22,0.51
  pour GND (isolate 0.152, rank 2): 0,0.51 0,10.26 3.43,10.26 3.43,22 22,22 22,0.51
N$1
  Top 0.127: D4.C 20.56,19.04 20.06,18.53 R8.2
N$2
  Bottom 0.127: U4.8 18.29,19.69 18.72,20.11 R3.1 R4.2
N$3
  Bottom 0.127: U4.9 R5.1
N$4
  Top 0.127: U2.47 9.2,14.55 7.53,16.22 R2.1 C27.2
N$5
  Top 0.33: L1.1 4.71,12.81 C8.1 3.79,12.79 A1.FEED
N$8
  Top 0.229: U2.2 7.52,12.8
  Top 0.33: 7.52,12.8 6.66,12.8 C10.1 6.62,12.83 L1.2
N$10
  Bottom 0.127: Q2.5 20.48,9.69 20.39,9.6 20.39,8.45 20.52,8.33 R17.2
N$12
  Bottom 0.127: Q2.2 18.61,9.69 18.46,9.84 18.46,11.5 18.64,11.68 R18.2
N$13
  Top 0.127: C3.2 8.76,16.95 Y1.P1 9.91,16.03 10,15.94 U2.45
N$15
  Top 0.127: C4.2 12.77,18.35 Y1.P3 11.55,18.35 10.78,17.59 10.78,16.3 10.4,15.92 U2.44
RTS
  Bottom 0.127: U4.19 20.29,13.32 20.58,13.03 20.58,12.32 20.52,12.26 R18.1 20.52,11.23 20.93,10.81 Q2.4
U0RXD  (via drill 0.2)
  Top 0.127: U2.40 12,14.39 13.06,15.45 13.89,15.45 v13.97,15.53
  PWR 0.127: v13.97,15.53 17.49,15.53 18.79,14.23 v18.79,12.89
  Bottom 0.127: v18.79,12.89 19.29,13.39 U4.21
U0TXD  (via drill 0.2)
  Top 0.127: U2.41 11.6,14.61 v12.36,15.37
  PWR 0.127: v20.15,12.79 20.15,13.95 17.91,16.19 14.48,16.19 14.35,16.32 13.31,16.32 v12.36,15.37
  Bottom 0.127: U4.20 19.79,13.15 v20.15,12.79
V_USB  (via drill 0.2)
  Top 0.127: J1.9 18.25,2.9 v18.42,3.07
  PWR 0.127: v18.42,3.07 18.44,3.05 19.18,3.05 19.94,3.81 19.94,11.25 21.08,12.39 21.08,16.64 20.32,17.4 v20.32,20.95
  Bottom 0.127: v20.32,20.95 20.73,20.54 R3.2
VDD  (via drill 0.2)
  Top 0.127: C24.1 14.73,7.87 | v14.48,7.49 14.48,7.62 14.73,7.87 | U2.26 14.42,9.2 14.73,8.89 14.73,7.87 | C17.1 14.35,16.5 13.63,15.79 11.94,15.79 v11.77,15.62
  GND 0.127: v14.48,7.49 14.48,8.59 13.27,9.8 13.27,13.23 11.92,14.58 11.92,15.48 v11.77,15.62
  Bottom 0.127: v11.77,15.62 v11.78,15.62 11.9,15.5 11.9,15 12.14,14.76 12.75,14.76 12.9,14.6 U1.8

### Text on the board
Top: 1
GND: 2
PWR: 3
Bottom: 4 | v11
tDocu: 0.8mm PCB / ENIG Finish / 45 degree chamfered edge / Four layer design | Alex Wende